# EAGLE schematic babymidiproto2_shield (EAGLE 6.5.0)
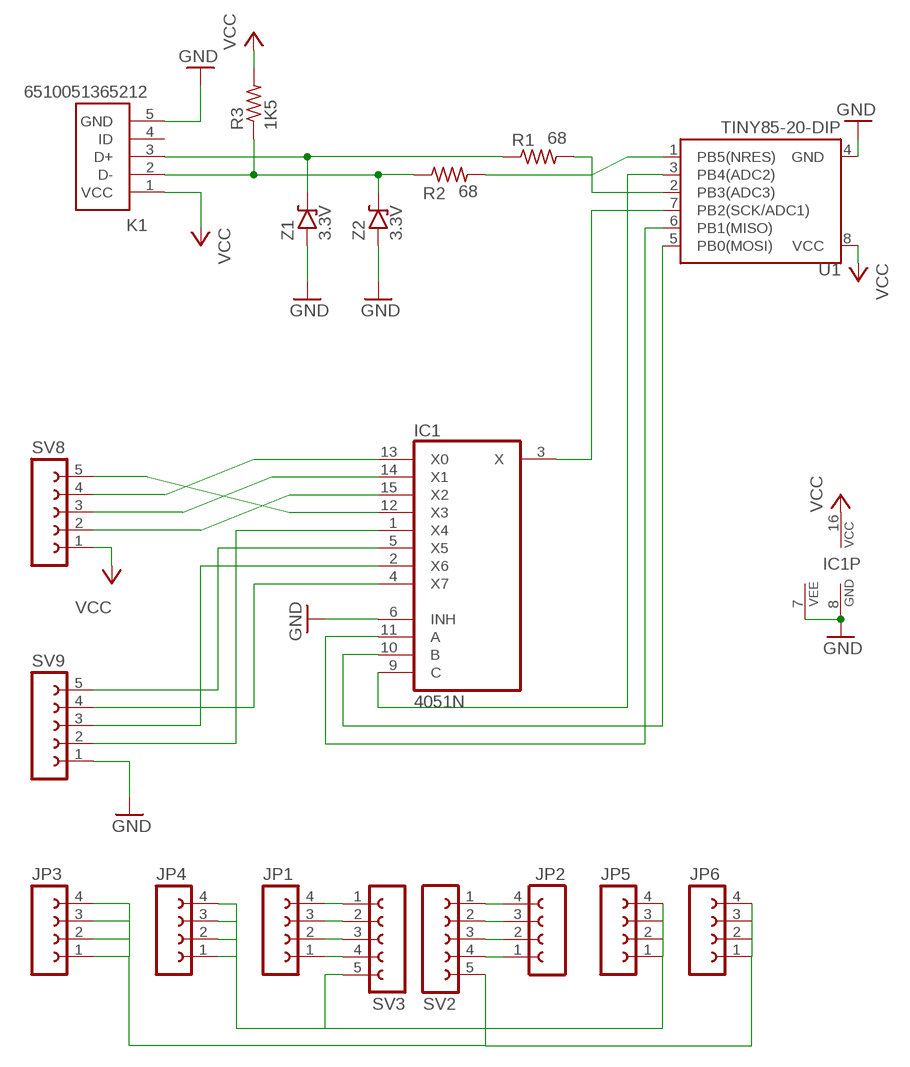
[diagram p0: schematic, sheet 1]

## Parts
IC1  4051N  [DIL16]
JP1  FE04-1SQBIG  [FE04-1-SQUARE-BIG]
JP2  FE04-1SQBIG  [FE04-1-SQUARE-BIG]
JP3  FE04-1SQBIG  [FE04-1-SQUARE-BIG]
JP4  FE04-1SQBIG  [FE04-1-SQUARE-BIG]
JP5  FE04-1SQBIG  [FE04-1-SQUARE-BIG]
JP6  FE04-1SQBIG  [FE04-1-SQUARE-BIG]
K1  6510051365212  [MINIUSB_DIP]
R1  68  7MM  [0703]
R2  68  7MM  [0703]
R3  1K5  7MM  [0703]
SV2  FE05-1SQBIGGER  [FE05-1-SQUARE-BIGGER]
SV3  FE05-1SQBIGGER  [FE05-1-SQUARE-BIGGER]
SV8  FE05-1SQBIG  [FE05-1-SQUARE-BIG]
SV9  FE05-1SQBIG  [FE05-1-SQUARE-BIG]
U1  TINY85-20-DIP  ATTINY45TINY85-20-DIP  [DIP08]
Z1  3.3V  1N47XX2  [DO41-2]
Z2  3.3V  1N47XX2  [DO41-2]

## Nets
GND: IC1.6(INH) IC1.7(VEE) IC1.8(GND) K1.5(GND) SV9.1 U1.4(GND) Z1.A Z2.A
N$1: R2.2 U1.1(PB5(NRES))
N$2: K1.3(D+) R1.1 Z1.C
N$3: K1.2(D-) R2.1 R3.1 Z2.C
N$4: R1.2 U1.2(PB3(ADC3))
N$5: IC1.3(X) U1.7(PB2(SCK/ADC1))
N$6: IC1.15(X2) SV8.2
N$7: IC1.14(X1) SV8.3
N$8: IC1.13(X0) SV8.4
N$10: IC1.12(X3) SV8.5
N$11: IC1.1(X4) SV9.2
N$12: IC1.2(X6) SV9.3
N$13: IC1.4(X7) SV9.4
N$14: IC1.5(X5) SV9.5
N$18: JP1.1 SV3.4
N$19: JP4.1 JP4.2 JP4.3 JP4.4 JP5.1 JP5.2 JP5.3 JP5.4 SV3.5
N$20: JP1.2 SV3.3
N$21: IC1.9(C) U1.3(PB4(ADC2))
N$22: IC1.10(B) U1.5(PB0(MOSI))
N$23: IC1.11(A) U1.6(PB1(MISO))
N$24: JP1.3 SV3.2
N$25: JP1.4 SV3.1
N$26: JP2.4 SV2.1
N$28: JP2.3 SV2.2
N$29: JP2.2 SV2.3
N$30: JP2.1 SV2.4
N$32: JP3.1 JP3.2 JP3.3 JP3.4 JP6.1 JP6.2 JP6.3 JP6.4 SV2.5
VCC: IC1.16(VCC) K1.1(VCC) R3.2 SV8.1 U1.8(VCC)
Unconnected: K1.4(ID)

## Library data of the parts
IC1 = manticore-lib:4051: 8-channel ANALOG MULTIPLEXER
JP1-JP6 = manticore-lib:FE04-1: FEMALE HEADER
K1 = manticore-lib:651005136521: WR-COM Horizontal 5 Contacts Mini USB Typ B
R1-R3 = manticore-lib:7MM: 7mm Resistors Suitable for some 1/2 watt resistors.
SV2 SV3 SV8 SV9 = manticore-lib:FE05-1: FEMALE HEADER
U1 = manticore-lib:ATTINY45: Atmel 8-pin 2/4/8kB flash uC; PROD_ID: IC-09445
Z1 Z2 = manticore-lib:1N47XX: Zener Diode 1N4728 - 1N4764: 3.3 V - 100V, 10% (1n47xxA 5%); DO-41 glass case